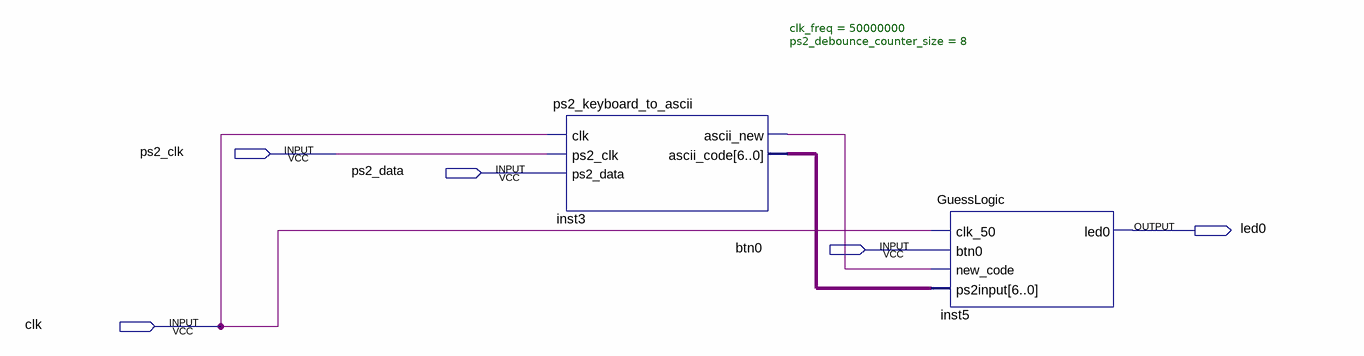
[diagram p0: schematic sheet]
// Quartus schematic FPGA_Password_Cracker.bdf as structural Verilog: 2 symbols, 5 pins
module FPGA_Password_Cracker (
  input  ps2_clk,
  input  ps2_data,
  input  btn0,
  input  clk,
  output led0
);

  wire inst3_ascii_new;
  wire [6:0] inst3_ascii_code;

  ps2_keyboard_to_ascii #(.clk_freq(50000000), .ps2_debounce_counter_size(8)) inst3 (
    .clk(clk), .ps2_clk(ps2_clk), .ps2_data(ps2_data), .ascii_new(inst3_ascii_new),
    .ascii_code(inst3_ascii_code));
  GuessLogic inst5 (.clk_50(clk), .btn0(btn0), .new_code(inst3_ascii_new), .ps2input(inst3_ascii_code), .led0(led0));
endmodule
